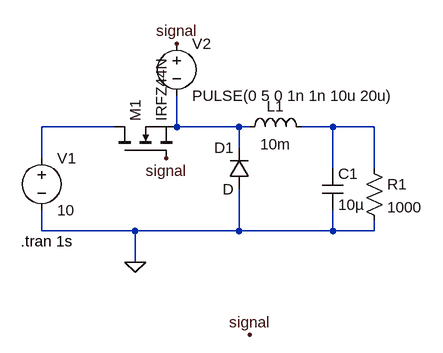
[diagram p0: schematic Buck-con.asc]
Buck-con.asc, the LTspice schematic file:
Version 4.1
SHEET 1 880 680
WIRE -80 96 -192 96
WIRE 16 96 16 48
WIRE 112 96 16 96
WIRE 128 96 112 96
WIRE 256 96 208 96
WIRE 320 96 256 96
WIRE 112 128 112 96
WIRE -192 144 -192 96
WIRE 256 160 256 96
WIRE 320 160 320 96
WIRE -192 256 -192 224
WIRE -48 256 -192 256
WIRE 112 256 112 192
WIRE 112 256 -48 256
WIRE 256 256 256 224
WIRE 256 256 112 256
WIRE 320 256 320 240
WIRE 320 256 256 256
WIRE -48 304 -48 256
FLAG -48 304 0
FLAG 16 -32 signal
FLAG 128 416 signal
FLAG 0 144 signal
SYMBOL voltage -192 128 R0
SYMATTR InstName V1
SYMATTR Value 10
SYMBOL res 304 144 R0
SYMATTR InstName R1
SYMATTR Value 1000
SYMBOL ind 112 112 R270
WINDOW 0 32 56 VTop 2
WINDOW 3 5 56 VBottom 2
SYMATTR InstName L1
SYMATTR Value 10m
SYMATTR SpiceLine Rser=1m
SYMBOL cap 240 160 R0
SYMATTR InstName C1
SYMATTR Value 10µ
SYMBOL diode 128 192 R180
WINDOW 0 24 64 Left 2
WINDOW 3 24 0 Left 2
SYMATTR InstName D1
SYMBOL nmos -80 144 R270
SYMATTR InstName M1
SYMATTR Value IRFZ44N
SYMBOL voltage 16 -48 R0
WINDOW 123 0 0 Left 0
WINDOW 39 0 0 Left 0
SYMATTR InstName V2
SYMATTR Value PULSE(0 5 0 1n 1n 10u 20u)
TEXT -224 272 Left 2 !.tran 1s

The netlist it stands for:
* Buck-con.asc
V1 N001 0 10
R1 N003 0 1000
L1 N002 N003 10m Rser=1m
C1 N003 0 10µ
D1 0 N002 D
M1 N001 signal N002 N002 IRFZ44N
V2 signal N002 PULSE(0 5 0 1n 1n 10u 20u)
.model D D
.lib standard.dio
.model NMOS NMOS
.model PMOS PMOS
.lib standard.mos
.tran 1s
.backanno
.end